# EAGLE schematic open-source-ruler (EAGLE 6.5.0)
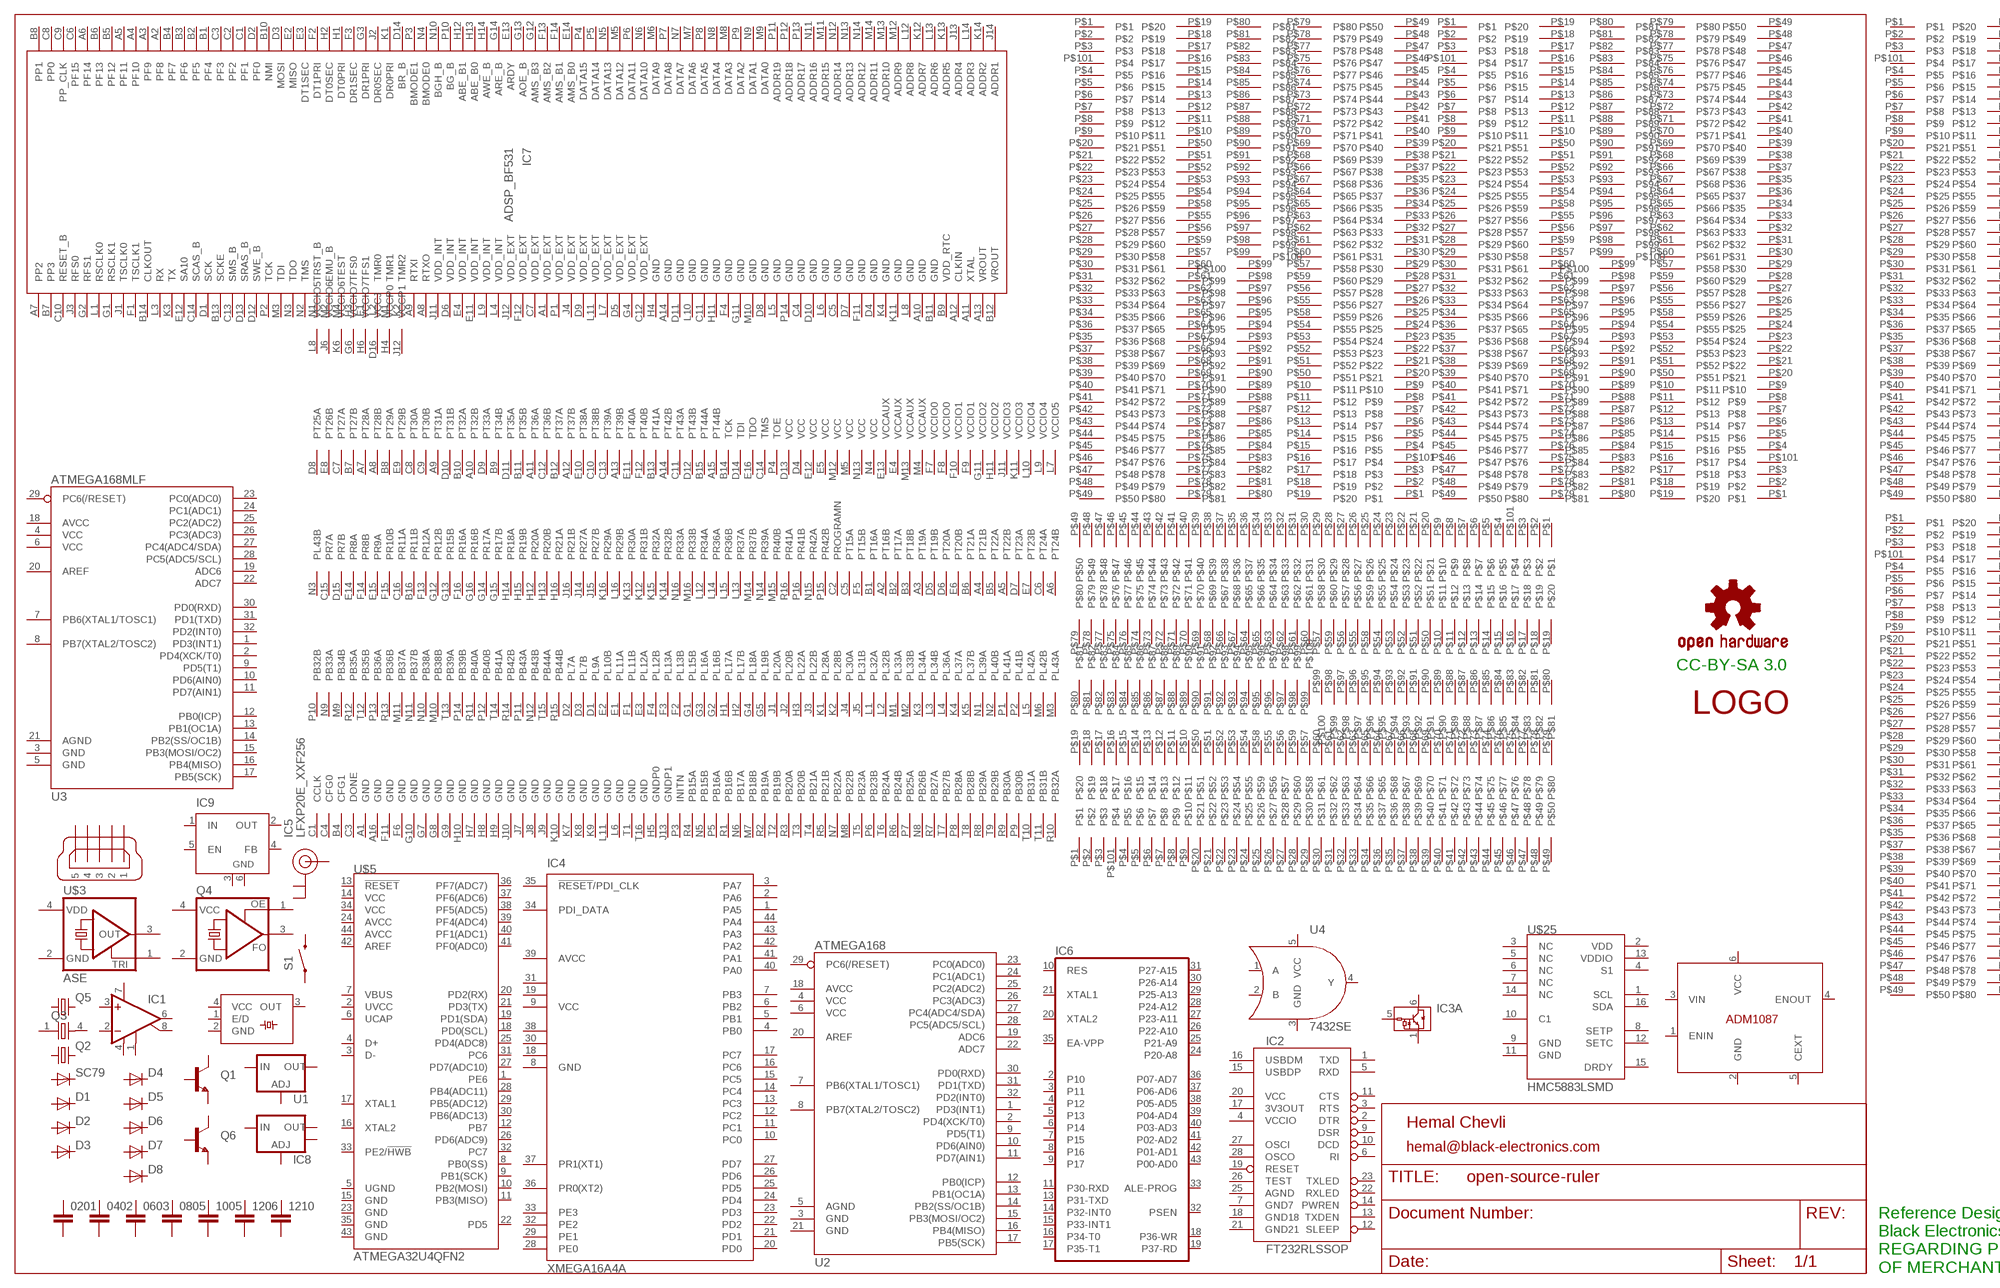
[diagram p0: schematic, sheet 1, part 1 of 2]
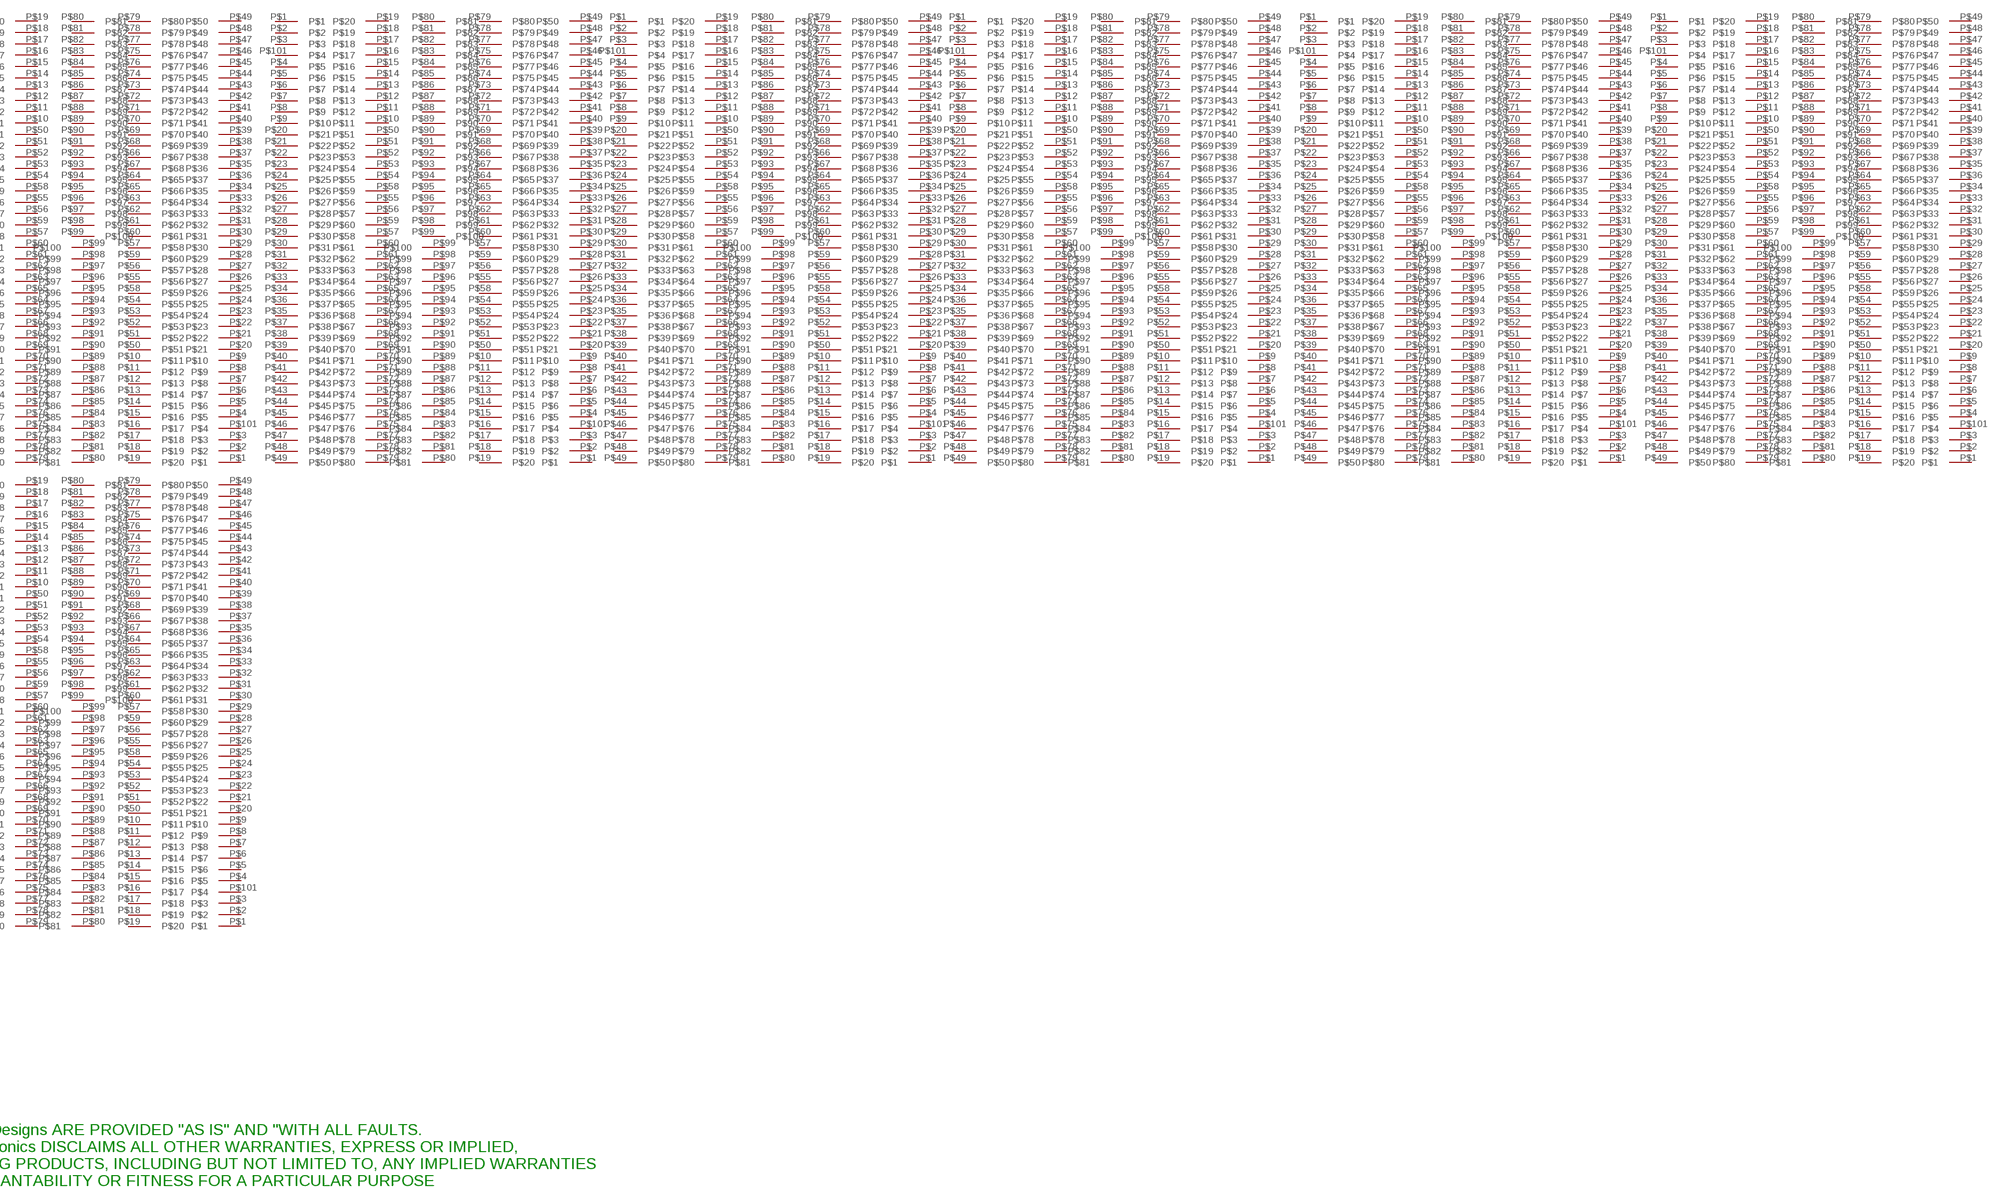
[diagram p1: schematic, sheet 1, part 2 of 2]

## Parts
0201  C-EUC0201  [C0201]
0402  C-EUC0402  [C0402]
0603  C-EUC0603  [C0603]
0805  C-EUC0805  [C0805]
1005  C-EUC1005  [C1005]
1206  C-EUC1206  [C1206]
1210  C-EUC1210  [C1210]
D1  DIODE-MICROMELF-R  [MICROMELF-R]
D2  DIODE-SOD323-R  [SOD323-R]
D3  DIODE-SOD80C  [SOD80C]
D4  DIODESMA  [SMA-DIODE]
D5  DIODE-SMB  [SMB]
D6  DIODE-SMC  [SMC]
D7  DIODE-MELF-MLL41  [MELF-MLL41]
D8  DIODE-MINIMELF  [MINIMELF]
IC1  LT1007CS8  [SO08]
IC2  FT232RLSSOP  [SSOP28DB]
IC3  MDC3105DMT1  [SC-74]
IC4  XMEGA16A4A  [TQFP44]
IC5  LFXP20E_XXF256  [FPBGA_256]
IC6  8751PLCC  [PLCC44]
IC7  ADSP_BF531  [MBGA_160]
IC8  V_REG_LM1117SOT223  [SOT223]
IC9  LM2596S  [TO263-5]
Q1  TRANSISTOR_NPNSOT23  [SOT23]
Q2  CRYSTALHC49UP  [HC49UP]
Q3  86SMX  [86SMX]
Q4  ASF1  [ASF]
Q5  CRYSTALCTS406  [CTS406]
Q6  TRANSISTOR_NPNSOT89  [SOT89]
QG1  SM77H  [SM77H]
S1  SWITCH-MOMENTARY-2  [TACTILE_SWITCH_TALL]
SC79  DIODE-SC79_INFINEON  [SC79_INFINEON]
U1  V_REG_317DPACK  [V-REG_DPACK]
U2  ATMEGA168  [TQFP32-08]
U3  ATMEGA168MLF  [MLF32]
U4  7432SE  [SOT353]
U$2  ADM1087SC-70  [SC-70]
U$3  ASE  [ASE]
U$4  PADS  [PADS]
U$5  ATMEGA32U4QFN2  [QFN-44-NOPAD]
U$6  PADS  [PADS]
U$7  PADS  [PADS]
U$8  PADS  [PADS]
U$9  PADS  [PADS]
U$10  PADS  [PADS]
U$11  PADS  [PADS]
U$12  PADS  [PADS]
U$13  PADS  [PADS]
U$14  PADS  [PADS]
U$15  PADS  [PADS]
U$16  PADS  [PADS]
U$17  PADS  [PADS]
U$18  PADS  [PADS]
U$19  PADS  [PADS]
U$20  PADS  [PADS]
U$21  PADS  [PADS]
U$22  PADS  [PADS]
U$23  PADS  [PADS]
U$24  PADS  [PADS]
U$25  HMC5883LSMD  [16LPCC]
U$26  U.FL  [U.FL]
U$27  LOGO_SMALL  [LOGO_SMALL]
U$28  OSHW-LOGOM  [OSHW-LOGO-M]
X1  MINI-USB-UX60A-MB-5ST  [UX60A-MB-5ST]
Unconnected: 0201.1 0201.2 0402.1 0402.2 0603.1 0603.2 0805.1 0805.2 1005.1 1005.2 1206.1 1206.2 1210.1 1210.2 D1.A D1.C D2.A D2.C D3.A D3.C D4.A D4.C D5.A D5.C D6.A D6.C D7.A D7.C D8.A D8.C IC1.1(CMP1) IC1.2(-IN) IC1.3(+IN) IC1.6(OUT) IC1.8(CMP2) IC2.1(TXD) IC2.2(DTR) IC2.3(RTS) IC2.5(RXD) IC2.6(RI) IC2.9(DSR) IC2.10(DCD) IC2.11(CTS) IC2.12(SLEEP) IC2.13(TXDEN) IC2.14(PWREN) IC2.15(USBDP) IC2.16(USBDM) IC2.17(3V3OUT) IC2.19(RESET) IC2.22(RXLED) IC2.23(TXLED) IC2.26(TEST) IC2.27(OSCI) IC2.28(OSCO) IC3.1(A:GND) IC3.2(B:VIN) IC3.3(B:VOUT) IC3.4(B:GND) IC3.5(A:VIN) IC3.6(A:VOUT) IC4.1(PA5) IC4.2(PA6) IC4.3(PA7) IC4.4(PB0) IC4.5(PB1) IC4.6(PB2) IC4.7(PB3) IC4.10(PC0) IC4.11(PC1) IC4.12(PC2) IC4.13(PC3) IC4.14(PC4) IC4.15(PC5) IC4.16(PC6) IC4.17(PC7) IC4.20(PD0) IC4.21(PD1) IC4.22(PD2) IC4.23(PD3) IC4.24(PD4) IC4.25(PD5) IC4.26(PD6) IC4.27(PD7) IC4.28(PE0) IC4.29(PE1) IC4.32(PE2) IC4.33(PE3) IC4.34(PDI_DATA) IC4.35(!RESET!/PDI_CLK) IC4.36(PR0(XT2)) IC4.37(PR1(XT1)) IC4.40(PA0) IC4.41(PA1) IC4.42(PA2) IC4.43(PA3) IC4.44(PA4) IC5.A2(PT16B) IC5.A3(PT19A) IC5.A4(PT21B) IC5.A5(PT22B) IC5.A6(PT24B) IC5.A7(PT28A) IC5.A8(PT28B) IC5.A9(PT31A) IC5.A10(PT32B) IC5.A11(PT36A) IC5.A12(PT37B) IC5.A13(PT39B) IC5.A14(PT42B) IC5.A15(PT44B) IC5.B1(PT16A) IC5.B2(PT17A) IC5.B3(PT18B) IC5.B4(CFG1) IC5.B5(PT22A) IC5.B6(PT21A) IC5.B7(PT27B) IC5.B8(PT29A) IC5.B9(PT34B) IC5.B10(PT32A) IC5.B11(PT35B) IC5.B12(PT37A) IC5.B13(PT41A) IC5.B14(TCK) IC5.B15(PT44A) IC5.B16(PR11B) IC5.C1(CCLK) IC5.C2(PROGRAMN) IC5.C3(DONE) IC5.C4(CFG0) IC5.C5(PT15A) IC5.C6(PT24A) IC5.C7(PT27A) IC5.C8(PT30A) IC5.C9(PT30B) IC5.C10(PT38B) IC5.C11(PT43A) IC5.C12(PT36B) IC5.C13(PT39A) IC5.C14(TMS) IC5.C15(PR7A) IC5.C16(PR11A) IC5.D1(PL9A) IC5.D2(PL7A) IC5.D3(PL7B) IC5.D5(PT19B) IC5.D6(PT20A) IC5.D7(PT23A) IC5.D8(PT25A) IC5.D9(PT33A) IC5.D10(PT31B) IC5.D11(PT35A) IC5.D12(PT43B) IC5.D14(TDI) IC5.D15(PR7B) IC5.E1(PL11A) IC5.E2(PL10B) IC5.E3(PL12A) IC5.E6(PT20B) IC5.E7(PT23B) IC5.E8(PT26B) IC5.E9(PT29B) IC5.E10(PT38A) IC5.E11(PT40A) IC5.E14(PR8A) IC5.E15(PR9A) IC5.E16(TDO) IC5.F1(PL11B) IC5.F2(PL13B) IC5.F3(PL13A) IC5.F4(PL12B) IC5.F5(PT15B) IC5.F12(PT40B) IC5.F13(PR12A) IC5.F14(PR8B) IC5.F15(PR10B) IC5.F16(PR16A) IC5.G1(PL15B) IC5.G2(PL16B) IC5.G3(PL16A) IC5.G4(PL18A) IC5.G5(PL19B) IC5.G12(PR12B) IC5.G13(PR15B) IC5.G14(PR17A) IC5.G15(PR17B) IC5.G16(PR16B) IC5.H1(PL17A) IC5.H2(PL17B) IC5.H3(PL22A) IC5.H12(PR20A) IC5.H13(PR20B) IC5.H14(PR18A) IC5.H15(PR19B) IC5.H16(PR21A) IC5.J1(PL20A) IC5.J2(PL20B) IC5.J3(PL22B) IC5.J4(PL30A) IC5.J5(PL31B) IC5.J14(PR27A) IC5.J15(PR27B) IC5.J16(PR21B) IC5.K1(PL28A) IC5.K2(PL28B) IC5.K3(PL34A) IC5.K4(PL37A) IC5.K5(PL37B) IC5.K12(PR31B) IC5.K13(PR30A) IC5.K14(PR32B) IC5.K15(PR32A) IC5.K16(PR29A) IC5.L1(PL32A) IC5.L2(PL32B) IC5.L3(PL34B) IC5.L4(PL36A) IC5.L5(PL42A) IC5.L12(PR34A) IC5.L13(PR37A) IC5.L14(PR36A) IC5.L15(PR36B) IC5.L16(PR29B) IC5.M1(PL33A) IC5.M2(PL33B) IC5.M3(PL43A) IC5.M6(PL42B) IC5.M7(PB18B) IC5.M8(PB22B) IC5.M9(PB34B) IC5.M10(PB38B) IC5.M11(PB37A) IC5.M14(PR37B) IC5.M15(PR40B) IC5.M16(PR33B) IC5.N1(PL39A) IC5.N2(PL40B) IC5.N3(PL43B) IC5.N5(PB15B) IC5.N6(PB17A) IC5.N7(PB22A) IC5.N8(PB26B) IC5.N9(PB33A) IC5.N10(PB38A) IC5.N11(PB37B) IC5.N12(PB43B) IC5.N14(PR39A) IC5.N15(PR42A) IC5.N16(PR33A) IC5.P1(PL41A) IC5.P2(PL41B) IC5.P3(INITN) IC5.P4(TOE) IC5.P5(PB16A) IC5.P6(PB23B) IC5.P7(PB25A) IC5.P8(PB28A) IC5.P9(PB30B) IC5.P10(PB32B) IC5.P11(PB43A) IC5.P12(PB40B) IC5.P13(PB36A) IC5.P14(PB39B) IC5.P15(PR42B) IC5.P16(PR41B) IC5.R1(PB16B) IC5.R2(PB19A) IC5.R3(PB20A) IC5.R4(PB15A) IC5.R5(PB21B) IC5.R6(PB24B) IC5.R7(PB27A) IC5.R8(PB29A) IC5.R9(PB30A) IC5.R10(PB32A) IC5.R11(PB40A) IC5.R12(PB35A) IC5.R13(PB36B) IC5.R14(PB42B) IC5.R15(PB44B) IC5.R16(PR41A) IC5.T2(PB19B) IC5.T3(PB20B) IC5.T4(PB21A) IC5.T5(PB23A) IC5.T6(PB24A) IC5.T7(PB27B) IC5.T8(PB28B) IC5.T9(PB29B) IC5.T10(PB31A) IC5.T11(PB31B) IC5.T12(PB35B) IC5.T13(PB39A) IC5.T14(PB41A) IC5.T15(PB44A) IC6.1(NC) IC6.2(P10) IC6.3(P11) IC6.4(P12) IC6.5(P13) IC6.6(P14) IC6.7(P15) IC6.8(P16) IC6.9(P17) IC6.10(RES) IC6.11(P30-RXD) IC6.12(NC) IC6.13(P31-TXD) IC6.14(P32-INT0) IC6.15(P33-INT1) IC6.16(P34-T0) IC6.17(P35-T1) IC6.18(P36-WR) IC6.19(P37-RD) IC6.20(XTAL2) IC6.21(XTAL1) IC6.23(NC) IC6.24(P20-A8) IC6.25(P21-A9) IC6.26(P22-A10) IC6.27(P23-A11) IC6.28(P24-A12) IC6.29(P25-A13) IC6.30(P26-A14) IC6.31(P27-A15) IC6.32(PSEN) IC6.33(ALE-PROG) IC6.34(NC) IC6.35(EA-VPP) IC6.36(P07-AD7) IC6.37(P06-AD6) IC6.38(P05-AD5) IC6.39(P04-AD4) IC6.40(P03-AD3) IC6.41(P02-AD2) IC6.42(P01-AD1) IC6.43(P00-AD0) IC7.A2(PF8) IC7.A3(PF9) IC7.A4(PF10) IC7.A5(PF11) IC7.A6(PF14) IC7.A7(PP2) IC7.B1(PF4) IC7.B2(PF5) IC7.B3(PF6) IC7.B4(PF7) IC7.B5(PF12) IC7.B6(PF13) IC7.B7(PP3) IC7.B8(PP1) IC7.B10(NMI) IC7.B13(SCKE) IC7.B14(CLKOUT) IC7.C1(PF1) IC7.C2(PF2) IC7.C3(PF3) IC7.C6(PF15) IC7.C8(PP0) IC7.C9(PP_CLK) IC7.C10(RESET_B) IC7.C13(SMS_B) IC7.C14(SCAS_B) IC7.D1(SCK) IC7.D2(PF0) IC7.D3(MOSI) IC7.D12(SWE_B) IC7.D13(SRAS_B) IC7.D14(BR_B) IC7.E1(TFS1) IC7.E2(MISO) IC7.E3(DT1SEC) IC7.E12(SA10) IC7.E13(ARDY) IC7.E14(AMS_B0) IC7.F1(TSCLK1) IC7.F2(DT1PRI) IC7.F3(DR1SEC) IC7.F13(AMS_B2) IC7.F14(AMS_B1) IC7.G1(RSCLK1) IC7.G2(RFS1) IC7.G3(DR1PRI) IC7.G12(AMS_B3) IC7.G13(AOE_B) IC7.G14(ARE_B) IC7.H1(DT0PRI) IC7.H2(DT0SEC) IC7.H3(TFS0) IC7.H12(ABE_B1) IC7.H13(ABE_B0) IC7.H14(AWE_B) IC7.J1(TSCLK0) IC7.J2(DR0SEC) IC7.J3(RFS0) IC7.J13(ADDR4) IC7.J14(ADDR1) IC7.K1(DR0PRI) IC7.K2(TMR2) IC7.K3(TX) IC7.K12(ADDR7) IC7.K13(ADDR5) IC7.K14(ADDR2) IC7.L1(RSCLK0) IC7.L2(TMR0) IC7.L3(RX) IC7.L12(ADDR8) IC7.L13(ADDR6) IC7.L14(ADDR3) IC7.M1(TMR1) IC7.M3(TDI) IC7.M4(TEST) IC7.M5(DATA12) IC7.M6(DATA9) IC7.M7(DATA6) IC7.M8(DATA3) IC7.M9(DATA0) IC7.M11(ADDR15) IC7.M12(ADDR9) IC7.M13(ADDR10) IC7.M14(ADDR11) IC7.N1(TRST_B) IC7.N2(TMS) IC7.N3(TDO) IC7.N4(BMODE0) IC7.N5(DATA13) IC7.N6(DATA10) IC7.N7(DATA7) IC7.N8(DATA4) IC7.N9(DATA1) IC7.N10(BGH_B) IC7.N11(ADDR16) IC7.N12(ADDR14) IC7.N13(ADDR13) IC7.N14(ADDR12) IC7.P2(TCK) IC7.P3(BMODE1) IC7.P4(DATA15) IC7.P5(DATA14) IC7.P6(DATA11) IC7.P7(DATA8) IC7.P8(DATA5) IC7.P9(DATA2) IC7.P10(BG_B) IC7.P11(ADDR19) IC7.P12(ADDR18) IC7.P13(ADDR17) IC8.1(ADJ) IC8.2(OUT) IC8.3(IN) IC8.4(OUT) IC9.1(IN) IC9.2(OUT) IC9.4(FB) IC9.5(EN) Q1.1(B) Q1.2(E) Q1.3(C) Q2.1 Q2.2 Q3.1 Q3.4 Q4.1(OE) Q4.3(FO) Q5.1 Q5.3 Q6.1(B) Q6.2(C) Q6.3(E) QG1.1(E/D) QG1.3(OUT) S1.A2 S1.B2 SC79.A SC79.C U1.1(ADJ) U1.3(IN) U1.4(OUT) U2.1(PD3(INT1)) U2.2(PD4(XCK/T0)) U2.3(GND) U2.4(VCC) U2.5(AGND) U2.6(VCC) U2.7(PB6(XTAL1/TOSC1)) U2.8(PB7(XTAL2/TOSC2)) U2.9(PD5(T1)) U2.10(PD6(AIN0)) U2.11(PD7(AIN1)) U2.12(PB0(ICP)) U2.13(PB1(OC1A)) U2.14(PB2(SS/OC1B)) U2.15(PB3(MOSI/OC2)) U2.16(PB4(MISO)) U2.17(PB5(SCK)) U2.18(AVCC) U2.19(ADC6) U2.20(AREF) U2.21(GND) U2.22(ADC7) U2.23(PC0(ADC0)) U2.24(PC1(ADC1)) U2.25(PC2(ADC2)) U2.26(PC3(ADC3)) U2.27(PC4(ADC4/SDA)) U2.28(PC5(ADC5/SCL)) U2.29(PC6(/RESET)) U2.30(PD0(RXD)) U2.31(PD1(TXD)) U2.32(PD2(INT0)) U3.1(PD3(INT1)) U3.2(PD4(XCK/T0)) U3.3(GND) U3.4(VCC) U3.5(GND) U3.6(VCC) U3.7(PB6(XTAL1/TOSC1)) U3.8(PB7(XTAL2/TOSC2)) U3.9(PD5(T1)) U3.10(PD6(AIN0)) U3.11(PD7(AIN1)) U3.12(PB0(ICP)) U3.13(PB1(OC1A)) U3.14(PB2(SS/OC1B)) U3.15(PB3(MOSI/OC2)) U3.16(PB4(MISO)) U3.17(PB5(SCK)) U3.18(AVCC) U3.19(ADC6) U3.20(AREF) U3.21(AGND) U3.22(ADC7) U3.23(PC0(ADC0)) U3.24(PC1(ADC1)) U3.25(PC2(ADC2)) U3.26(PC3(ADC3)) U3.27(PC4(ADC4/SDA)) U3.28(PC5(ADC5/SCL)) U3.29(PC6(/RESET)) U3.30(PD0(RXD)) U3.31(PD1(TXD)) U3.32(PD2(INT0)) U4.1(A) U4.2(B) U4.3(GND) U4.4(Y) U4.5(VCC) U$2.1(ENIN) U$2.2(GND) U$2.3(VIN) U$2.4(ENOUT) U$2.5(CEXT) U$2.6(VCC) U$3.1(TRI) U$3.3(OUT) U$4.P$1 U$4.P$2 U$4.P$3 U$4.P$4 U$4.P$5 U$4.P$6 U$4.P$7 U$4.P$8 U$4.P$9 U$4.P$10 U$4.P$11 U$4.P$12 U$4.P$13 U$4.P$14 U$4.P$15 U$4.P$16 U$4.P$17 U$4.P$18 U$4.P$19 U$4.P$20 U$4.P$21 U$4.P$22 U$4.P$23 U$4.P$24 U$4.P$25 U$4.P$26 U$4.P$27 U$4.P$28 U$4.P$29 U$4.P$30 U$4.P$31 U$4.P$32 U$4.P$33 U$4.P$34 U$4.P$35 U$4.P$36 U$4.P$37 U$4.P$38 U$4.P$39 U$4.P$40 U$4.P$41 U$4.P$42 U$4.P$43 U$4.P$44 U$4.P$45 U$4.P$46 U$4.P$47 U$4.P$48 U$4.P$49 U$4.P$50 U$4.P$51 U$4.P$52 U$4.P$53 U$4.P$54 U$4.P$55 U$4.P$56 U$4.P$57 U$4.P$58 U$4.P$59 U$4.P$60 U$4.P$61 U$4.P$62 U$4.P$63 U$4.P$64 U$4.P$65 U$4.P$66 U$4.P$67 U$4.P$68 U$4.P$69 U$4.P$70 U$4.P$71 U$4.P$72 U$4.P$73 U$4.P$74 U$4.P$75 U$4.P$76 U$4.P$77 U$4.P$78 U$4.P$79 U$4.P$80 U$4.P$81 U$4.P$82 U$4.P$83 U$4.P$84 U$4.P$85 U$4.P$86 U$4.P$87 U$4.P$88 U$4.P$89 U$4.P$90 U$4.P$91 U$4.P$92 U$4.P$93 U$4.P$94 U$4.P$95 U$4.P$96 U$4.P$97 U$4.P$98 U$4.P$99 U$4.P$101 U$5.1(PE6) U$5.2(UVCC) U$5.3(D-) U$5.4(D+) U$5.5(UGND) U$5.6(UCAP) U$5.7(VBUS) U$5.8(PB0(SS)) U$5.9(PB1(SCK)) U$5.10(PB2(MOSI)) U$5.11(PB3(MISO)) U$5.12(PB7) U$5.13(!RESET) U$5.14(VCC) U$5.15(GND) U$5.16(XTAL2) U$5.17(XTAL1) U$5.18(PD0(SCL)) U$5.19(PD1(SDA)) U$5.20(PD2(RX)) U$5.21(PD3(TX)) U$5.22(PD5) U$5.23(GND) U$5.24(AVCC) U$5.25(PD4(ADC8)) U$5.26(PD6(ADC9)) U$5.27(PD7(ADC10)) U$5.28(PB4(ADC11)) U$5.29(PB5(ADC12)) U$5.30(PB6(ADC13)) U$5.31(PC6) U$5.32(PC7) U$5.33(PE2/!HWB) U$5.34(VCC) U$5.35(GND) U$5.36(PF7(ADC7)) U$5.37(PF6(ADC6)) U$5.38(PF5(ADC5)) U$5.39(PF4(ADC4)) U$5.40(PF1(ADC1)) U$5.41(PF0(ADC0)) U$5.42(AREF) U$5.43(GND) U$5.44(AVCC) U$6.P$1 U$6.P$2 U$6.P$3 U$6.P$4 U$6.P$5 U$6.P$6 U$6.P$7 U$6.P$8 U$6.P$9 U$6.P$10 U$6.P$11 U$6.P$12 U$6.P$13 U$6.P$14 U$6.P$15 U$6.P$16 U$6.P$17 U$6.P$18 U$6.P$19 U$6.P$20 U$6.P$21 U$6.P$22 U$6.P$23 U$6.P$24 U$6.P$25 U$6.P$26 U$6.P$27 U$6.P$28 U$6.P$29 U$6.P$30 U$6.P$31 U$6.P$32 U$6.P$33 U$6.P$34 U$6.P$35 U$6.P$36 U$6.P$37 U$6.P$38 U$6.P$39 U$6.P$40 U$6.P$41 U$6.P$42 U$6.P$43 U$6.P$44 U$6.P$45 U$6.P$46 U$6.P$47 U$6.P$48 U$6.P$49 U$6.P$50 U$6.P$51 U$6.P$52 U$6.P$53 U$6.P$54 U$6.P$55 U$6.P$56 U$6.P$57 U$6.P$58 U$6.P$59 U$6.P$60 U$6.P$61 U$6.P$62 U$6.P$63 U$6.P$64 U$6.P$65 U$6.P$66 U$6.P$67 U$6.P$68 U$6.P$69 U$6.P$70 U$6.P$71 U$6.P$72 U$6.P$73 U$6.P$74 U$6.P$75 U$6.P$76 U$6.P$77 U$6.P$78 U$6.P$79 U$6.P$80 U$6.P$81 U$6.P$82 U$6.P$83 U$6.P$84 U$6.P$85 U$6.P$86 U$6.P$87 U$6.P$88 U$6.P$89 U$6.P$90 U$6.P$91 U$6.P$92 U$6.P$93 U$6.P$94 U$6.P$95 U$6.P$96 U$6.P$97 U$6.P$98 U$6.P$99 U$6.P$101 U$7.P$1 U$7.P$2 U$7.P$3 U$7.P$4 U$7.P$5 U$7.P$6 U$7.P$7 U$7.P$8 U$7.P$9 U$7.P$10 U$7.P$11 U$7.P$12 U$7.P$13 U$7.P$14 U$7.P$15 U$7.P$16 U$7.P$17 U$7.P$18 U$7.P$19 U$7.P$20 U$7.P$21 U$7.P$22 U$7.P$23 U$7.P$24 U$7.P$25 U$7.P$26 U$7.P$27 U$7.P$28 U$7.P$29 U$7.P$30 U$7.P$31 U$7.P$32 U$7.P$33 U$7.P$34 U$7.P$35 U$7.P$36 U$7.P$37 U$7.P$38 U$7.P$39 U$7.P$40 U$7.P$41 U$7.P$42 U$7.P$43 U$7.P$44 U$7.P$45 U$7.P$46 U$7.P$47 U$7.P$48 U$7.P$49 U$7.P$50 U$7.P$51 U$7.P$52 U$7.P$53 U$7.P$54 U$7.P$55 U$7.P$56 U$7.P$57 U$7.P$58 U$7.P$59 U$7.P$60 U$7.P$61 U$7.P$62 U$7.P$63 U$7.P$64 U$7.P$65 U$7.P$66 U$7.P$67 U$7.P$68 U$7.P$69 U$7.P$70 U$7.P$71 U$7.P$72 U$7.P$73 U$7.P$74 U$7.P$75 U$7.P$76 U$7.P$77 U$7.P$78 U$7.P$79 U$7.P$80 U$7.P$81 U$7.P$82 U$7.P$83 U$7.P$84 U$7.P$85 U$7.P$86 U$7.P$87 U$7.P$88 U$7.P$89 U$7.P$90 U$7.P$91 U$7.P$92 U$7.P$93 U$7.P$94 U$7.P$95 U$7.P$96 U$7.P$97 U$7.P$98 U$7.P$99 U$7.P$101 U$8.P$1 U$8.P$2 U$8.P$3 U$8.P$4 U$8.P$5 U$8.P$6 U$8.P$7 U$8.P$8 U$8.P$9 U$8.P$10 U$8.P$11 U$8.P$12 U$8.P$13 U$8.P$14 U$8.P$15 U$8.P$16 U$8.P$17 U$8.P$18 U$8.P$19 U$8.P$20 U$8.P$21 U$8.P$22 U$8.P$23 U$8.P$24 U$8.P$25 U$8.P$26 U$8.P$27 U$8.P$28 U$8.P$29 U$8.P$30 U$8.P$31 U$8.P$32 U$8.P$33 U$8.P$34 U$8.P$35 U$8.P$36 U$8.P$37 U$8.P$38 U$8.P$39 U$8.P$40 U$8.P$41 U$8.P$42 U$8.P$43 U$8.P$44 U$8.P$45 U$8.P$46 U$8.P$47 U$8.P$48 U$8.P$49 U$8.P$50 U$8.P$51 U$8.P$52 U$8.P$53 U$8.P$54 U$8.P$55 U$8.P$56 U$8.P$57 U$8.P$58 U$8.P$59 U$8.P$60 U$8.P$61 U$8.P$62 U$8.P$63 U$8.P$64 U$8.P$65 U$8.P$66 U$8.P$67 U$8.P$68 U$8.P$69 U$8.P$70 U$8.P$71 U$8.P$72 U$8.P$73 U$8.P$74 U$8.P$75 U$8.P$76 U$8.P$77 U$8.P$78 U$8.P$79 U$8.P$80 U$8.P$81 U$8.P$82 U$8.P$83 U$8.P$84 U$8.P$85 U$8.P$86 U$8.P$87 U$8.P$88 U$8.P$89 U$8.P$90 U$8.P$91 U$8.P$92 U$8.P$93 U$8.P$94 U$8.P$95 U$8.P$96 U$8.P$97 U$8.P$98 U$8.P$99 U$8.P$101 U$9.P$1 U$9.P$2 U$9.P$3 U$9.P$4 U$9.P$5 U$9.P$6 U$9.P$7 U$9.P$8 U$9.P$9 U$9.P$10 U$9.P$11 U$9.P$12 U$9.P$13 U$9.P$14 U$9.P$15 U$9.P$16 U$9.P$17 U$9.P$18 U$9.P$19 U$9.P$20 U$9.P$21 U$9.P$22 U$9.P$23 U$9.P$24 U$9.P$25 U$9.P$26 U$9.P$27 U$9.P$28 U$9.P$29 U$9.P$30 U$9.P$31 U$9.P$32 U$9.P$33 U$9.P$34 U$9.P$35 U$9.P$36 U$9.P$37 U$9.P$38 U$9.P$39 U$9.P$40 U$9.P$41 U$9.P$42 U$9.P$43 U$9.P$44 U$9.P$45 U$9.P$46 U$9.P$47 U$9.P$48 U$9.P$49 U$9.P$50 U$9.P$51 U$9.P$52 U$9.P$53 U$9.P$54 U$9.P$55 U$9.P$56 U$9.P$57 U$9.P$58 U$9.P$59 U$9.P$60 U$9.P$61 U$9.P$62 U$9.P$63 U$9.P$64 U$9.P$65 U$9.P$66 U$9.P$67 U$9.P$68 U$9.P$69 U$9.P$70 U$9.P$71 U$9.P$72 U$9.P$73 U$9.P$74 U$9.P$75 U$9.P$76 U$9.P$77 U$9.P$78 U$9.P$79 U$9.P$80 U$9.P$81 U$9.P$82 U$9.P$83 U$9.P$84 U$9.P$85 U$9.P$86 U$9.P$87 U$9.P$88 U$9.P$89 U$9.P$90 U$9.P$91 U$9.P$92 U$9.P$93 U$9.P$94 U$9.P$95 U$9.P$96 U$9.P$97 U$9.P$98 U$9.P$99 U$9.P$101 U$10.P$1 U$10.P$2 U$10.P$3 U$10.P$4 U$10.P$5 U$10.P$6 U$10.P$7 U$10.P$8 U$10.P$9 U$10.P$10 U$10.P$11 U$10.P$12 U$10.P$13 U$10.P$14 U$10.P$15 U$10.P$16 U$10.P$17 U$10.P$18 U$10.P$19 U$10.P$20 U$10.P$21 U$10.P$22 U$10.P$23 U$10.P$24 U$10.P$25 U$10.P$26 U$10.P$27 U$10.P$28 U$10.P$29 U$10.P$30 U$10.P$31 U$10.P$32 U$10.P$33 U$10.P$34 U$10.P$35 U$10.P$36 U$10.P$37 U$10.P$38 U$10.P$39 U$10.P$40 U$10.P$41 U$10.P$42 U$10.P$43 U$10.P$44 U$10.P$45 U$10.P$46 U$10.P$47 U$10.P$48 U$10.P$49 U$10.P$50 U$10.P$51 U$10.P$52 U$10.P$53 U$10.P$54 U$10.P$55 U$10.P$56 U$10.P$57 U$10.P$58 U$10.P$59 U$10.P$60 U$10.P$61 U$10.P$62 U$10.P$63 U$10.P$64 U$10.P$65 U$10.P$66 U$10.P$67 U$10.P$68 U$10.P$69 U$10.P$70 U$10.P$71 U$10.P$72 U$10.P$73 U$10.P$74 U$10.P$75 U$10.P$76 U$10.P$77 U$10.P$78 U$10.P$79 U$10.P$80 U$10.P$81 U$10.P$82 U$10.P$83 U$10.P$84 U$10.P$85 U$10.P$86 U$10.P$87 U$10.P$88 U$10.P$89 U$10.P$90 U$10.P$91 U$10.P$92 U$10.P$93 U$10.P$94 U$10.P$95 U$10.P$96 U$10.P$97 U$10.P$98 U$10.P$99 U$10.P$101 U$11.P$1 U$11.P$2 U$11.P$3 U$11.P$4 U$11.P$5 U$11.P$6 U$11.P$7 U$11.P$8 U$11.P$9 U$11.P$10 U$11.P$11 U$11.P$12 U$11.P$13 U$11.P$14 U$11.P$15 U$11.P$16 U$11.P$17 U$11.P$18 U$11.P$19 U$11.P$20 U$11.P$21 U$11.P$22 U$11.P$23 U$11.P$24 U$11.P$25 U$11.P$26 U$11.P$27 U$11.P$28 U$11.P$29 U$11.P$30 U$11.P$31 U$11.P$32 U$11.P$33 U$11.P$34 U$11.P$35 U$11.P$36 U$11.P$37 U$11.P$38 U$11.P$39 U$11.P$40 U$11.P$41 U$11.P$42 U$11.P$43 U$11.P$44 U$11.P$45 U$11.P$46 U$11.P$47 U$11.P$48 U$11.P$49 U$11.P$50 U$11.P$51 U$11.P$52 U$11.P$53 U$11.P$54 U$11.P$55 U$11.P$56 U$11.P$57 U$11.P$58 U$11.P$59 U$11.P$60 U$11.P$61 U$11.P$62 U$11.P$63 U$11.P$64 U$11.P$65 U$11.P$66 U$11.P$67 U$11.P$68 U$11.P$69 U$11.P$70 U$11.P$71 U$11.P$72 U$11.P$73 U$11.P$74 U$11.P$75 U$11.P$76 U$11.P$77 U$11.P$78 U$11.P$79 U$11.P$80 U$11.P$81 U$11.P$82 U$11.P$83 U$11.P$84 U$11.P$85 U$11.P$86 U$11.P$87 U$11.P$88 U$11.P$89 U$11.P$90 U$11.P$91 U$11.P$92 U$11.P$93 U$11.P$94 U$11.P$95 U$11.P$96 U$11.P$97 U$11.P$98 U$11.P$99 U$11.P$101 U$12.P$1 U$12.P$2 U$12.P$3 U$12.P$4 U$12.P$5 U$12.P$6 U$12.P$7 U$12.P$8 U$12.P$9 U$12.P$10 U$12.P$11 U$12.P$12 U$12.P$13 U$12.P$14 U$12.P$15 U$12.P$16 U$12.P$17 U$12.P$18 U$12.P$19 U$12.P$20 U$12.P$21 U$12.P$22 U$12.P$23 U$12.P$24 U$12.P$25 U$12.P$26 U$12.P$27 U$12.P$28 U$12.P$29 U$12.P$30 U$12.P$31 U$12.P$32 U$12.P$33 U$12.P$34 U$12.P$35 U$12.P$36 U$12.P$37 U$12.P$38 U$12.P$39 U$12.P$40 U$12.P$41 U$12.P$42 U$12.P$43 U$12.P$44 U$12.P$45 U$12.P$46 U$12.P$47 U$12.P$48 U$12.P$49 U$12.P$50 U$12.P$51 U$12.P$52 U$12.P$53 U$12.P$54 U$12.P$55 U$12.P$56 U$12.P$57 U$12.P$58 U$12.P$59 U$12.P$60 U$12.P$61 U$12.P$62 U$12.P$63 U$12.P$64 U$12.P$65 U$12.P$66 U$12.P$67 U$12.P$68 U$12.P$69 U$12.P$70 U$12.P$71 U$12.P$72 U$12.P$73 U$12.P$74 U$12.P$75 U$12.P$76 U$12.P$77 U$12.P$78 U$12.P$79 U$12.P$80 U$12.P$81 U$12.P$82 U$12.P$83 U$12.P$84 U$12.P$85 U$12.P$86 U$12.P$87 U$12.P$88 U$12.P$89 U$12.P$90 U$12.P$91 U$12.P$92 U$12.P$93 U$12.P$94 U$12.P$95 U$12.P$96 U$12.P$97 U$12.P$98 U$12.P$99 U$12.P$101 U$13.P$1 U$13.P$2 U$13.P$3 U$13.P$4 U$13.P$5 U$13.P$6 U$13.P$7 U$13.P$8 U$13.P$9 U$13.P$10 U$13.P$11 U$13.P$12 U$13.P$13 U$13.P$14 U$13.P$15 U$13.P$16 U$13.P$17 U$13.P$18 U$13.P$19 U$13.P$20 U$13.P$21 U$13.P$22 U$13.P$23 U$13.P$24 U$13.P$25 U$13.P$26 U$13.P$27 U$13.P$28 U$13.P$29 U$13.P$30 U$13.P$31 U$13.P$32 U$13.P$33 U$13.P$34 U$13.P$35 U$13.P$36 U$13.P$37 U$13.P$38 U$13.P$39 U$13.P$40 U$13.P$41 U$13.P$42 U$13.P$43 U$13.P$44 U$13.P$45 U$13.P$46 U$13.P$47 U$13.P$48 U$13.P$49 U$13.P$50 U$13.P$51 U$13.P$52 U$13.P$53 U$13.P$54 U$13.P$55 U$13.P$56 U$13.P$57 U$13.P$58 U$13.P$59 U$13.P$60 U$13.P$61 U$13.P$62 U$13.P$63 U$13.P$64 U$13.P$65 U$13.P$66 U$13.P$67 U$13.P$68 U$13.P$69 U$13.P$70 U$13.P$71 U$13.P$72 U$13.P$73 U$13.P$74 U$13.P$75 U$13.P$76 U$13.P$77 U$13.P$78 U$13.P$79 U$13.P$80 U$13.P$81 U$13.P$82 U$13.P$83 U$13.P$84 U$13.P$85 U$13.P$86 U$13.P$87 U$13.P$88 U$13.P$89 U$13.P$90 U$13.P$91 U$13.P$92 U$13.P$93 U$13.P$94 U$13.P$95 U$13.P$96 U$13.P$97 U$13.P$98 U$13.P$99 U$13.P$101 U$14.P$1 U$14.P$2 U$14.P$3 U$14.P$4 U$14.P$5 U$14.P$6 U$14.P$7 U$14.P$8 U$14.P$9 U$14.P$10 U$14.P$11 U$14.P$12 U$14.P$13 U$14.P$14 U$14.P$15 U$14.P$16 U$14.P$17 U$14.P$18 U$14.P$19 U$14.P$20 U$14.P$21 U$14.P$22 U$14.P$23 U$14.P$24 U$14.P$25 U$14.P$26 U$14.P$27 U$14.P$28 U$14.P$29 U$14.P$30 U$14.P$31 U$14.P$32 U$14.P$33 U$14.P$34 U$14.P$35 U$14.P$36 U$14.P$37 U$14.P$38 U$14.P$39 U$14.P$40 U$14.P$41 U$14.P$42 U$14.P$43 U$14.P$44 U$14.P$45 U$14.P$46 U$14.P$47 U$14.P$48 U$14.P$49 U$14.P$50 U$14.P$51 U$14.P$52 U$14.P$53 U$14.P$54 U$14.P$55 U$14.P$56 U$14.P$57 U$14.P$58 U$14.P$59 U$14.P$60 U$14.P$61 U$14.P$62 U$14.P$63 U$14.P$64 U$14.P$65 U$14.P$66 U$14.P$67 U$14.P$68 U$14.P$69 U$14.P$70 U$14.P$71 U$14.P$72 U$14.P$73 U$14.P$74 U$14.P$75 U$14.P$76 U$14.P$77 U$14.P$78 U$14.P$79 U$14.P$80 U$14.P$81 U$14.P$82 U$14.P$83 U$14.P$84 U$14.P$85 U$14.P$86 U$14.P$87 U$14.P$88 U$14.P$89 U$14.P$90 U$14.P$91 U$14.P$92 U$14.P$93 U$14.P$94 U$14.P$95 U$14.P$96 U$14.P$97 U$14.P$98 U$14.P$99 U$14.P$101 U$15.P$1 U$15.P$2 U$15.P$3 U$15.P$4 U$15.P$5 U$15.P$6 U$15.P$7 U$15.P$8 U$15.P$9 U$15.P$10 U$15.P$11 U$15.P$12 U$15.P$13 U$15.P$14 U$15.P$15 U$15.P$16 U$15.P$17 U$15.P$18 U$15.P$19 U$15.P$20 U$15.P$21 U$15.P$22 U$15.P$23 U$15.P$24 U$15.P$25 U$15.P$26 U$15.P$27 U$15.P$28 U$15.P$29 U$15.P$30 U$15.P$31 U$15.P$32 U$15.P$33 U$15.P$34 U$15.P$35 U$15.P$36 U$15.P$37 U$15.P$38 U$15.P$39 U$15.P$40 U$15.P$41 U$15.P$42 U$15.P$43 U$15.P$44 U$15.P$45 U$15.P$46 U$15.P$47 U$15.P$48 U$15.P$49 U$15.P$50 U$15.P$51 U$15.P$52 U$15.P$53 U$15.P$54 U$15.P$55 U$15.P$56 U$15.P$57 U$15.P$58 U$15.P$59 U$15.P$60 U$15.P$61 U$15.P$62 U$15.P$63 U$15.P$64 U$15.P$65 U$15.P$66 U$15.P$67 U$15.P$68 U$15.P$69 U$15.P$70 U$15.P$71 U$15.P$72 U$15.P$73 U$15.P$74 U$15.P$75 U$15.P$76 U$15.P$77 U$15.P$78 U$15.P$79 U$15.P$80 U$15.P$81 U$15.P$82 U$15.P$83 U$15.P$84 U$15.P$85 U$15.P$86 U$15.P$87 U$15.P$88 U$15.P$89 U$15.P$90 U$15.P$91 U$15.P$92 U$15.P$93 U$15.P$94 U$15.P$95 U$15.P$96 U$15.P$97 U$15.P$98 U$15.P$99 U$15.P$101 U$16.P$1 U$16.P$2 U$16.P$3 U$16.P$4 U$16.P$5 U$16.P$6 U$16.P$7 U$16.P$8 U$16.P$9 U$16.P$10 U$16.P$11 U$16.P$12 U$16.P$13 U$16.P$14 U$16.P$15 U$16.P$16 U$16.P$17 U$16.P$18 U$16.P$19 U$16.P$20 U$16.P$21 U$16.P$22 U$16.P$23 U$16.P$24 U$16.P$25 U$16.P$26 U$16.P$27 U$16.P$28 U$16.P$29 U$16.P$30 U$16.P$31 U$16.P$32 U$16.P$33 U$16.P$34 U$16.P$35 U$16.P$36 U$16.P$37 U$16.P$38 U$16.P$39 U$16.P$40 U$16.P$41 U$16.P$42 U$16.P$43 U$16.P$44 U$16.P$45 U$16.P$46 U$16.P$47 U$16.P$48 U$16.P$49 U$16.P$50 U$16.P$51 U$16.P$52 U$16.P$53 U$16.P$54 U$16.P$55 U$16.P$56 U$16.P$57 U$16.P$58 U$16.P$59 U$16.P$60 U$16.P$61 U$16.P$62 U$16.P$63 U$16.P$64 U$16.P$65 U$16.P$66 U$16.P$67 U$16.P$68 U$16.P$69 U$16.P$70 U$16.P$71 U$16.P$72 U$16.P$73 U$16.P$74 U$16.P$75 U$16.P$76 U$16.P$77 U$16.P$78 U$16.P$79 U$16.P$80 U$16.P$81 U$16.P$82 U$16.P$83 U$16.P$84 U$16.P$85 U$16.P$86 U$16.P$87 U$16.P$88 U$16.P$89 U$16.P$90 U$16.P$91 U$16.P$92 U$16.P$93 U$16.P$94 U$16.P$95 U$16.P$96 U$16.P$97 U$16.P$98 U$16.P$99 U$16.P$101 U$17.P$1 U$17.P$2 U$17.P$3 U$17.P$4 U$17.P$5 U$17.P$6 U$17.P$7 U$17.P$8 U$17.P$9 U$17.P$10 U$17.P$11 U$17.P$12 U$17.P$13 U$17.P$14 U$17.P$15 U$17.P$16 U$17.P$17 U$17.P$18 U$17.P$19 U$17.P$20 U$17.P$21 U$17.P$22 U$17.P$23 U$17.P$24 U$17.P$25 U$17.P$26 U$17.P$27 U$17.P$28 U$17.P$29 U$17.P$30 U$17.P$31 U$17.P$32 U$17.P$33 U$17.P$34 U$17.P$35 U$17.P$36 U$17.P$37 U$17.P$38 U$17.P$39 U$17.P$40 U$17.P$41 U$17.P$42 U$17.P$43 U$17.P$44 U$17.P$45 U$17.P$46 U$17.P$47 U$17.P$48 U$17.P$49 U$17.P$50 U$17.P$51 U$17.P$52 U$17.P$53 U$17.P$54 U$17.P$55 U$17.P$56 U$17.P$57 U$17.P$58 U$17.P$59 U$17.P$60 U$17.P$61 U$17.P$62 U$17.P$63 U$17.P$64 U$17.P$65 U$17.P$66 U$17.P$67 U$17.P$68 U$17.P$69 U$17.P$70 U$17.P$71 U$17.P$72 U$17.P$73 U$17.P$74 U$17.P$75 U$17.P$76 U$17.P$77 U$17.P$78 U$17.P$79 U$17.P$80 U$17.P$81 U$17.P$82 U$17.P$83 U$17.P$84 U$17.P$85 U$17.P$86 U$17.P$87 U$17.P$88 U$17.P$89 U$17.P$90 U$17.P$91 U$17.P$92 U$17.P$93 U$17.P$94 U$17.P$95 U$17.P$96 U$17.P$97 U$17.P$98 U$17.P$99 U$17.P$101 U$18.P$1 U$18.P$2 U$18.P$3 U$18.P$4 U$18.P$5 U$18.P$6 U$18.P$7 U$18.P$8 U$18.P$9 U$18.P$10 U$18.P$11 U$18.P$12 U$18.P$13 U$18.P$14 U$18.P$15 U$18.P$16 U$18.P$17 U$18.P$18 U$18.P$19 U$18.P$20 U$18.P$21 U$18.P$22 U$18.P$23 U$18.P$24 U$18.P$25 U$18.P$26 U$18.P$27 U$18.P$28 U$18.P$29 U$18.P$30 U$18.P$31 U$18.P$32 U$18.P$33 U$18.P$34 U$18.P$35 U$18.P$36 U$18.P$37 U$18.P$38 U$18.P$39 U$18.P$40 U$18.P$41 U$18.P$42 U$18.P$43 U$18.P$44 U$18.P$45 U$18.P$46 U$18.P$47 U$18.P$48 U$18.P$49 U$18.P$50 U$18.P$51 U$18.P$52 U$18.P$53 U$18.P$54 U$18.P$55 U$18.P$56 U$18.P$57 U$18.P$58 U$18.P$59 U$18.P$60 U$18.P$61 U$18.P$62 U$18.P$63 U$18.P$64 U$18.P$65 U$18.P$66 U$18.P$67 U$18.P$68 U$18.P$69 U$18.P$70 U$18.P$71 U$18.P$72 U$18.P$73 U$18.P$74 U$18.P$75 U$18.P$76 U$18.P$77 U$18.P$78 U$18.P$79 U$18.P$80 U$18.P$81 U$18.P$82 U$18.P$83 U$18.P$84 U$18.P$85 U$18.P$86 U$18.P$87 U$18.P$88 U$18.P$89 U$18.P$90 U$18.P$91 U$18.P$92 U$18.P$93 U$18.P$94 U$18.P$95 U$18.P$96 U$18.P$97 U$18.P$98 U$18.P$99 U$18.P$101 U$19.P$1 U$19.P$2 U$19.P$3 U$19.P$4 U$19.P$5 U$19.P$6 U$19.P$7 U$19.P$8 U$19.P$9 U$19.P$10 U$19.P$11 U$19.P$12 U$19.P$13 U$19.P$14 U$19.P$15 U$19.P$16 U$19.P$17 U$19.P$18 U$19.P$19 U$19.P$20 U$19.P$21 U$19.P$22 U$19.P$23 U$19.P$24 U$19.P$25 U$19.P$26 U$19.P$27 U$19.P$28 U$19.P$29 U$19.P$30 U$19.P$31 U$19.P$32 U$19.P$33 U$19.P$34 U$19.P$35 U$19.P$36 U$19.P$37 U$19.P$38 U$19.P$39 U$19.P$40 U$19.P$41 U$19.P$42 U$19.P$43 U$19.P$44 U$19.P$45 U$19.P$46 U$19.P$47 U$19.P$48 U$19.P$49 U$19.P$50 U$19.P$51 U$19.P$52 U$19.P$53 U$19.P$54 U$19.P$55 U$19.P$56 U$19.P$57 U$19.P$58 U$19.P$59 U$19.P$60 U$19.P$61 U$19.P$62 U$19.P$63 U$19.P$64 U$19.P$65 U$19.P$66 U$19.P$67 U$19.P$68 U$19.P$69 U$19.P$70 U$19.P$71 U$19.P$72 U$19.P$73 U$19.P$74 U$19.P$75 U$19.P$76 U$19.P$77 U$19.P$78 U$19.P$79 U$19.P$80 U$19.P$81 U$19.P$82 U$19.P$83 U$19.P$84 U$19.P$85 U$19.P$86 U$19.P$87 U$19.P$88 U$19.P$89 U$19.P$90 U$19.P$91 U$19.P$92 U$19.P$93 U$19.P$94 U$19.P$95 U$19.P$96 U$19.P$97 U$19.P$98 U$19.P$99 U$19.P$101 U$20.P$1 U$20.P$2 U$20.P$3 U$20.P$4 U$20.P$5 U$20.P$6 U$20.P$7 U$20.P$8 U$20.P$9 U$20.P$10 U$20.P$11 U$20.P$12 U$20.P$13 U$20.P$14 U$20.P$15 U$20.P$16 U$20.P$17 U$20.P$18 U$20.P$19 U$20.P$20 U$20.P$21 U$20.P$22 U$20.P$23 U$20.P$24 U$20.P$25 U$20.P$26 U$20.P$27 U$20.P$28 U$20.P$29 U$20.P$30 U$20.P$31 U$20.P$32 U$20.P$33 U$20.P$34 U$20.P$35 U$20.P$36 U$20.P$37 U$20.P$38 U$20.P$39 U$20.P$40 U$20.P$41 U$20.P$42 U$20.P$43 U$20.P$44 U$20.P$45 U$20.P$46 U$20.P$47 U$20.P$48 U$20.P$49 U$20.P$50 U$20.P$51 U$20.P$52 U$20.P$53 U$20.P$54 U$20.P$55 U$20.P$56 U$20.P$57 U$20.P$58 U$20.P$59 U$20.P$60 U$20.P$61 U$20.P$62 U$20.P$63 U$20.P$64 U$20.P$65 U$20.P$66 U$20.P$67 U$20.P$68 U$20.P$69 U$20.P$70 U$20.P$71 U$20.P$72 U$20.P$73 U$20.P$74 U$20.P$75 U$20.P$76 U$20.P$77 U$20.P$78 U$20.P$79 U$20.P$80 U$20.P$81 U$20.P$82 U$20.P$83 U$20.P$84 U$20.P$85 U$20.P$86 U$20.P$87 U$20.P$88 U$20.P$89 U$20.P$90 U$20.P$91 U$20.P$92 U$20.P$93 U$20.P$94 U$20.P$95 U$20.P$96 U$20.P$97 U$20.P$98 U$20.P$99 U$20.P$101 U$21.P$1 U$21.P$2 U$21.P$3 U$21.P$4 U$21.P$5 U$21.P$6 U$21.P$7 U$21.P$8 U$21.P$9 U$21.P$10 U$21.P$11 U$21.P$12 U$21.P$13 U$21.P$14 U$21.P$15 U$21.P$16 U$21.P$17 U$21.P$18 U$21.P$19 U$21.P$20 U$21.P$21 U$21.P$22 U$21.P$23 U$21.P$24 U$21.P$25 U$21.P$26 U$21.P$27 U$21.P$28 U$21.P$29 U$21.P$30 U$21.P$31 U$21.P$32 U$21.P$33 U$21.P$34 U$21.P$35 U$21.P$36 U$21.P$37 U$21.P$38 U$21.P$39 U$21.P$40 U$21.P$41 U$21.P$42 U$21.P$43 U$21.P$44 U$21.P$45 U$21.P$46 U$21.P$47 U$21.P$48 U$21.P$49 U$21.P$50 U$21.P$51 U$21.P$52 U$21.P$53 U$21.P$54 U$21.P$55 U$21.P$56 U$21.P$57 U$21.P$58 U$21.P$59 U$21.P$60 U$21.P$61 U$21.P$62 U$21.P$63 U$21.P$64 U$21.P$65 U$21.P$66 U$21.P$67 U$21.P$68 U$21.P$69 U$21.P$70 U$21.P$71 U$21.P$72 U$21.P$73 U$21.P$74 U$21.P$75 U$21.P$76 U$21.P$77 U$21.P$78 U$21.P$79 U$21.P$80 U$21.P$81 U$21.P$82 U$21.P$83 U$21.P$84 U$21.P$85 U$21.P$86 U$21.P$87 U$21.P$88 U$21.P$89 U$21.P$90 U$21.P$91 U$21.P$92 U$21.P$93 U$21.P$94 U$21.P$95 U$21.P$96 U$21.P$97 U$21.P$98 U$21.P$99 U$21.P$101 U$22.P$1 U$22.P$2 U$22.P$3 U$22.P$4 U$22.P$5 U$22.P$6 U$22.P$7 U$22.P$8 U$22.P$9 U$22.P$10 U$22.P$11 U$22.P$12 U$22.P$13 U$22.P$14 U$22.P$15 U$22.P$16 U$22.P$17 U$22.P$18 U$22.P$19 U$22.P$20 U$22.P$21 U$22.P$22 U$22.P$23 U$22.P$24 U$22.P$25 U$22.P$26 U$22.P$27 U$22.P$28 U$22.P$29 U$22.P$30 U$22.P$31 U$22.P$32 U$22.P$33 U$22.P$34 U$22.P$35 U$22.P$36 U$22.P$37 U$22.P$38 U$22.P$39 U$22.P$40 U$22.P$41 U$22.P$42 U$22.P$43 U$22.P$44 U$22.P$45 U$22.P$46 U$22.P$47 U$22.P$48 U$22.P$49 U$22.P$50 U$22.P$51 U$22.P$52 U$22.P$53 U$22.P$54 U$22.P$55 U$22.P$56 U$22.P$57 U$22.P$58 U$22.P$59 U$22.P$60 U$22.P$61 U$22.P$62 U$22.P$63 U$22.P$64 U$22.P$65 U$22.P$66 U$22.P$67 U$22.P$68 U$22.P$69 U$22.P$70 U$22.P$71 U$22.P$72 U$22.P$73 U$22.P$74 U$22.P$75 U$22.P$76 U$22.P$77 U$22.P$78 U$22.P$79 U$22.P$80 U$22.P$81 U$22.P$82 U$22.P$83 U$22.P$84 U$22.P$85 U$22.P$86 U$22.P$87 U$22.P$88 U$22.P$89 U$22.P$90 U$22.P$91 U$22.P$92 U$22.P$93 U$22.P$94 U$22.P$95 U$22.P$96 U$22.P$97 U$22.P$98 U$22.P$99 U$22.P$101 U$23.P$1 U$23.P$2 U$23.P$3 U$23.P$4 U$23.P$5 U$23.P$6 U$23.P$7 U$23.P$8 U$23.P$9 U$23.P$10 U$23.P$11 U$23.P$12 U$23.P$13 U$23.P$14 U$23.P$15 U$23.P$16 U$23.P$17 U$23.P$18 U$23.P$19 U$23.P$20 U$23.P$21 U$23.P$22 U$23.P$23 U$23.P$24 U$23.P$25 U$23.P$26 U$23.P$27 U$23.P$28 U$23.P$29 U$23.P$30 U$23.P$31 U$23.P$32 U$23.P$33 U$23.P$34 U$23.P$35 U$23.P$36 U$23.P$37 U$23.P$38 U$23.P$39 U$23.P$40 U$23.P$41 U$23.P$42 U$23.P$43 U$23.P$44 U$23.P$45 U$23.P$46 U$23.P$47 U$23.P$48 U$23.P$49 U$23.P$50 U$23.P$51 U$23.P$52 U$23.P$53 U$23.P$54 U$23.P$55 U$23.P$56 U$23.P$57 U$23.P$58 U$23.P$59 U$23.P$60 U$23.P$61 U$23.P$62 U$23.P$63 U$23.P$64 U$23.P$65 U$23.P$66 U$23.P$67 U$23.P$68 U$23.P$69 U$23.P$70 U$23.P$71 U$23.P$72 U$23.P$73 U$23.P$74 U$23.P$75 U$23.P$76 U$23.P$77 U$23.P$78 U$23.P$79 U$23.P$80 U$23.P$81 U$23.P$82 U$23.P$83 U$23.P$84 U$23.P$85 U$23.P$86 U$23.P$87 U$23.P$88 U$23.P$89 U$23.P$90 U$23.P$91 U$23.P$92 U$23.P$93 U$23.P$94 U$23.P$95 U$23.P$96 U$23.P$97 U$23.P$98 U$23.P$99 U$23.P$101 U$24.P$1 U$24.P$2 U$24.P$3 U$24.P$4 U$24.P$5 U$24.P$6 U$24.P$7 U$24.P$8 U$24.P$9 U$24.P$10 U$24.P$11 U$24.P$12 U$24.P$13 U$24.P$14 U$24.P$15 U$24.P$16 U$24.P$17 U$24.P$18 U$24.P$19 U$24.P$20 U$24.P$21 U$24.P$22 U$24.P$23 U$24.P$24 U$24.P$25 U$24.P$26 U$24.P$27 U$24.P$28 U$24.P$29 U$24.P$30 U$24.P$31 U$24.P$32 U$24.P$33 U$24.P$34 U$24.P$35 U$24.P$36 U$24.P$37 U$24.P$38 U$24.P$39 U$24.P$40 U$24.P$41 U$24.P$42 U$24.P$43 U$24.P$44 U$24.P$45 U$24.P$46 U$24.P$47 U$24.P$48 U$24.P$49 U$24.P$50 U$24.P$51 U$24.P$52 U$24.P$53 U$24.P$54 U$24.P$55 U$24.P$56 U$24.P$57 U$24.P$58 U$24.P$59 U$24.P$60 U$24.P$61 U$24.P$62 U$24.P$63 U$24.P$64 U$24.P$65 U$24.P$66 U$24.P$67 U$24.P$68 U$24.P$69 U$24.P$70 U$24.P$71 U$24.P$72 U$24.P$73 U$24.P$74 U$24.P$75 U$24.P$76 U$24.P$77 U$24.P$78 U$24.P$79 U$24.P$80 U$24.P$81 U$24.P$82 U$24.P$83 U$24.P$84 U$24.P$85 U$24.P$86 U$24.P$87 U$24.P$88 U$24.P$89 U$24.P$90 U$24.P$91 U$24.P$92 U$24.P$93 U$24.P$94 U$24.P$95 U$24.P$96 U$24.P$97 U$24.P$98 U$24.P$99 U$24.P$101 U$25.1(SCL) U$25.2(VDD) U$25.3(NC) U$25.4(S1) U$25.5(NC) U$25.6(NC) U$25.7(NC) U$25.8(SETP) U$25.9(GND) U$25.10(C1) U$25.11(GND) U$25.12(SETC) U$25.13(VDDIO) U$25.14(NC) U$25.15(DRDY) U$25.16(SDA) U$26.P$1(GND) U$26.P$2(GND) U$26.P$3(SIGNAL) X1.1 X1.2 X1.3 X1.4 X1.5

## Notes on the sheet
- CC-BY-SA 3.0
- Hemal Chevli
- hemal@black-electronics.com
- Reference Designs ARE PROVIDED "AS IS" AND "WITH ALL FAULTS.
  Black Electronics DISCLAIMS ALL OTHER WARRANTIES, EXPRESS OR IMPLIED,
  REGARDING PRODUCTS, INCLUDING BUT NOT LIMITED TO, ANY IMPLIED WARRANTIES
  OF MERCHANTABILITY OR FITNESS FOR A PARTICULAR PURPOSE

## Power pins joined to a net without a drawn wire
AGND: IC2.25(AGND)
AVCC: IC4.39(AVCC)
CLKIN: IC7.A12(CLKIN)
EMU_B: IC7.M2(EMU_B)
GND: IC4.8(GND) IC5.A1(GND) IC5.A16(GND) IC5.F6(GND) IC5.F11(GND) IC5.G7(GND) IC5.G8(GND) IC5.G9(GND) IC5.G10(GND) IC5.H7(GND) IC5.H8(GND) IC5.H9(GND) IC5.H10(GND) IC5.J7(GND) IC5.J8(GND) IC5.J9(GND) IC5.J10(GND) IC5.K7(GND) IC5.K8(GND) IC5.K9(GND) IC5.K10(GND) IC5.L6(GND) IC5.L11(GND) IC5.T1(GND) IC5.T16(GND) IC6.22(GND) IC7.A10(GND) IC7.A14(GND) IC7.B11(GND) IC7.C4(GND) IC7.C5(GND) IC7.C11(GND) IC7.D4(GND) IC7.D7(GND) IC7.D8(GND) IC7.D10(GND) IC7.D11(GND) IC7.F4(GND) IC7.F11(GND) IC7.G11(GND) IC7.H4(GND) IC7.H11(GND) IC7.K4(GND) IC7.K11(GND) IC7.L5(GND) IC7.L6(GND) IC7.L8(GND) IC7.L10(GND) IC7.M10(GND) IC7.P14(GND) IC9.3(GND) IC9.6(GND) Q4.2(GND) QG1.2(GND) U$3.2(GND)
GND1: IC4.18(GND1)
GND2: IC4.30(GND2)
GND3: IC4.38(GND3)
GND7: IC2.7(GND7)
GND18: IC2.18(GND18)
GND21: IC2.21(GND21)
GNDP0: IC5.H5(GNDP0)
GNDP1: IC5.J13(GNDP1)
RTXI: IC7.A9(RTXI)
RTXO: IC7.A8(RTXO)
V+: IC1.7(V+)
V-: IC1.4(V-)
VCC: IC2.20(VCC) IC4.9(VCC) IC5.D4(VCC) IC5.D13(VCC) IC5.E5(VCC) IC5.E12(VCC) IC5.M5(VCC) IC5.M12(VCC) IC5.N4(VCC) IC5.N13(VCC) IC6.44(VCC) Q4.4(VCC) QG1.4(VCC)
VCC1: IC4.19(VCC1)
VCC2: IC4.31(VCC2)
VCCAUX: IC5.E4(VCCAUX) IC5.E13(VCCAUX) IC5.M4(VCCAUX) IC5.M13(VCCAUX)
VCCIO: IC2.4(VCCIO)
VCCIO0: IC5.F7(VCCIO0) IC5.F8(VCCIO0)
VCCIO1: IC5.F9(VCCIO1) IC5.F10(VCCIO1)
VCCIO2: IC5.G11(VCCIO2) IC5.H11(VCCIO2)
VCCIO3: IC5.J11(VCCIO3) IC5.K11(VCCIO3)
VCCIO4: IC5.L9(VCCIO4) IC5.L10(VCCIO4)
VCCIO5: IC5.L7(VCCIO5) IC5.L8(VCCIO5)
VCCIO6: IC5.J6(VCCIO6) IC5.K6(VCCIO6)
VCCIO7: IC5.G6(VCCIO7) IC5.H6(VCCIO7)
VCCJ: IC5.D16(VCCJ)
VCCP0: IC5.H4(VCCP0)
VCCP1: IC5.J12(VCCP1)
VDD: U$3.4(VDD)
VDD_EXT: IC7.A1(VDD_EXT) IC7.C7(VDD_EXT) IC7.C12(VDD_EXT) IC7.D5(VDD_EXT) IC7.D9(VDD_EXT) IC7.F12(VDD_EXT) IC7.G4(VDD_EXT) IC7.J4(VDD_EXT) IC7.J12(VDD_EXT) IC7.L7(VDD_EXT) IC7.L11(VDD_EXT) IC7.P1(VDD_EXT)
VDD_INT: IC7.D6(VDD_INT) IC7.E4(VDD_INT) IC7.E11(VDD_INT) IC7.J11(VDD_INT) IC7.L4(VDD_INT) IC7.L9(VDD_INT)
VDD_RTC: IC7.B9(VDD_RTC)
VROUT: IC7.A13(VROUT) IC7.B12(VROUT)
XTAL: IC7.A11(XTAL)

## Library data of the parts
0201 0402 0603 0805 1005 1206 1210 = rcl:C-EU: CAPACITOR, European symbol
D1-D3 D5-D8 SC79 = diode:DIODE-: DIODE
D4 = SparkFun:DIODE: Diode These are standard reverse protection diodes and small signal diodes. SMA package can handle up to about 1A. SOD-323 can handle about 200mA. What the SOD-323 package when ordering, there are some mfgs out there that are 5-pin packages.
IC1 = linear:LT10*: Low Noise, High Speed, Precision Operational Amplifiers Source: http://www.linear.com/pc/downloadDocument.do?navId=H0,C1,C1154,C1009,C1026,P1212,D2204
IC2 = SparkFun:FT232RL: USB UART FT232RL 4th Generation USB UART (USB <-> Serial) Controller. Spark Fun Electronics SKU : COM-00650
IC3 = on-semiconductor:MDC3105DMT1: Integrated Relay, Inductive Load Driver Sopurce: U6 OnSemi Inductive Load Driver MDC3105-D.PDF; MPN: MDC3105DMT1G; OC_FARNELL: unknown; OC_NEWARK: 04R7836
IC4 = atmel:XMEGA16A4: MICROCONTROLLER Features High-performance, Low-power 8/16-bit AVR XMEGA Microcontroller Non-Volatile Program and Data Memories - 16 KB - 128 KB of In-System Self-Programmable Flash - 4 KB - 8 KB Boot Code Section with Independent Lock Bits - 1 KB - 2 KB EEPROM - 2 KB - 8 KB Internal SRAM Peripheral Features - Four-channel DMA Controller with support for external requests - Eight-channel Event System - Five 16-bit Timer/Counters Three Timer/Counters with 4 Output Compare or Input Capture channels Two Timer/Counters with 2 Output Compare or Input Capture channels High-Resolution Extensions on all Timer/Counters Advanced Waveform Extension on one Timer/Counter - Five USARTs IrDA Extension on one USART - Two Two-Wire Interfaces with dual address match (I2C and SMBus compatible) - Two SPIs (Serial Peripheral Interfaces) peripherals - AES and DES Crypto Engine - 16-bit Real Time Counter with Separate Oscillator - One Twelve-channel, 12-bit, 2 Msps Analog to Digital Converter - One Two-channel, 12-bit, 1 Msps Digital to Analog Converter - Two Analog Comparators with Window compare function - External Interrupts on all General Purpose I/O pins - Programmable Watchdog Timer with Separate On-chip Ultra Low Power Oscillator Special Microcontroller Features - Power-on Reset and Programmable Brown-out Detection - Internal and External Clock Options with PLL - Programmable Multi-level Interrupt Controller - Sleep Modes: Idle, Power-down, Standby, Power-save, Extended Standby - Advanced Programming, Test and Debugging Interfaces PDI (Program and Debug Interface) for programming, test and debugging I/O and Packages - 34 Programmable I/O Lines - 44 - lead TQFP - 44 - pad VQFN/QFN - 49 - ball VFBGA Operating Voltage - 1.6 - 3.6V Speed performance - 0 - 12 MHz @ 1.6 - 3.6V - 0 - 32 MHz @ 2.7 - 3.6V Drawn by Dipl.-Ing. (FH) Robert Siegler Created: 27.05.09; OC_FARNELL: unknown; OC_NEWARK: unknown
IC5 = lattice:LFXP20E_XXF256: lfxp20e_fpbga256 edit this description Auto generated by make-symbol-device-package-bsdl.ulp Rev. 20 Source: lfxp20e_fpbga256.bsm; OC_FARNELL: unknown; OC_NEWARK: unknown
IC6 = micro-intel:8751PLCC: MICROCOMPUTER/PERIPHERAL DEVICE; OC_FARNELL: unknown; OC_NEWARK: unknown
IC7 = analog-devices:ADSP_BF531: ADSP BF531 Auto generated by make-symbol-device-package-bsdl.ulp Rev. 8 Source: 33170285923617ADSP_BF531_mbga.bsdl; OC_FARNELL: unknown; OC_NEWARK: unknown
IC8 = SparkFun:V_REG_LM1117: Voltage Regulator LM1117 Standard adjustable voltage regulator but in SMD form. Spark Fun Electronics SKU : COM-00595
IC9 = linear:LM2596S: STEP-DOWN VOLTAGE REGULATOR
Q1 Q6 = SparkFun:TRANSISTOR_NPN: Transistor NPN BJT configuration in SOT23 package. MMBT2222 is the common NPN we use. Double check BCE configuration again layout.
Q2 Q5 = crystal:CRYSTAL: CRYSTAL; OC_FARNELL: unknown; OC_NEWARK: unknown
Q3 = crystal:86SMX: CRYSTAL; MF: C-MAC FREQUENCY PRODUCTS LTD; MPN: XTAL003321- 86SMX; OC_FARNELL: 6344914; OC_NEWARK: 01H9866
Q4 = crystal:ASF*: CRYSTAL CLOCK OSCILLATORS 5.0 Vdc or 3.3 Vdc - LOW PROFILE ULTRA MINIATURE CERAMIC SURFACE MOUNT Source: http://www.abracon.com/Oscillators/asf1-L-L1.pdf; OC_FARNELL: unknown; OC_NEWARK: unknown
QG1 = crystal:SM77H: 3.3V CMOS Clock Oscillator Source: www.pletronics.com .. sm77h%203.3v.pdf; OC_FARNELL: unknown; OC_NEWARK: unknown
S1 = SparkFun:SWITCH-MOMENTARY-2
U1 = SparkFun:V_REG_317: Voltage Regulator Standard LM317 adjustable voltage regulator. AOI (Adjust Output Input). Google 'LM317 Calculator' for easy to use app to get the two resistor values needed. 240/720 for 5V output. 240/390 for 3.3V output. Spark Fun Electronics SKU : COM-00527
U2 U3 = SparkFun:ATMEGA168
U4 = SparkFun:74*32: Single 2-input OR gate
U$2 = SparkFun:ADM1087
U$3 = crystal:ASE: 3.3Vdc CMOS SMD CRYSTAL CLOCK OSCILLATOR SOurce: www.abracon.com; OC_FARNELL: unknown; OC_NEWARK: unknown
U$4 U$6-U$24 = my:PADS
U$5 = SparkFun:ATMEGA32U4
U$25 = SparkFun:HMC5883L: 3 Axis Digital Compass IC
U$26 = SparkFun:U.FL
U$27 = my:LOGO_SMALL
U$28 = SparkFun:OSHW-LOGO: Open Source Hardware Logo This logo indicates the piece of hardware it is found on incorporates a OSHW license and/or adheres to the definition of open source hardware found here: http://freedomdefined.org/OSHW
X1 = usb:MINI-USB-: MINI USB Connector Source: http://www.hirose.co.jp/cataloge_hp/e24000019.pdf; OC_FARNELL: unknown; OC_NEWARK: unknown